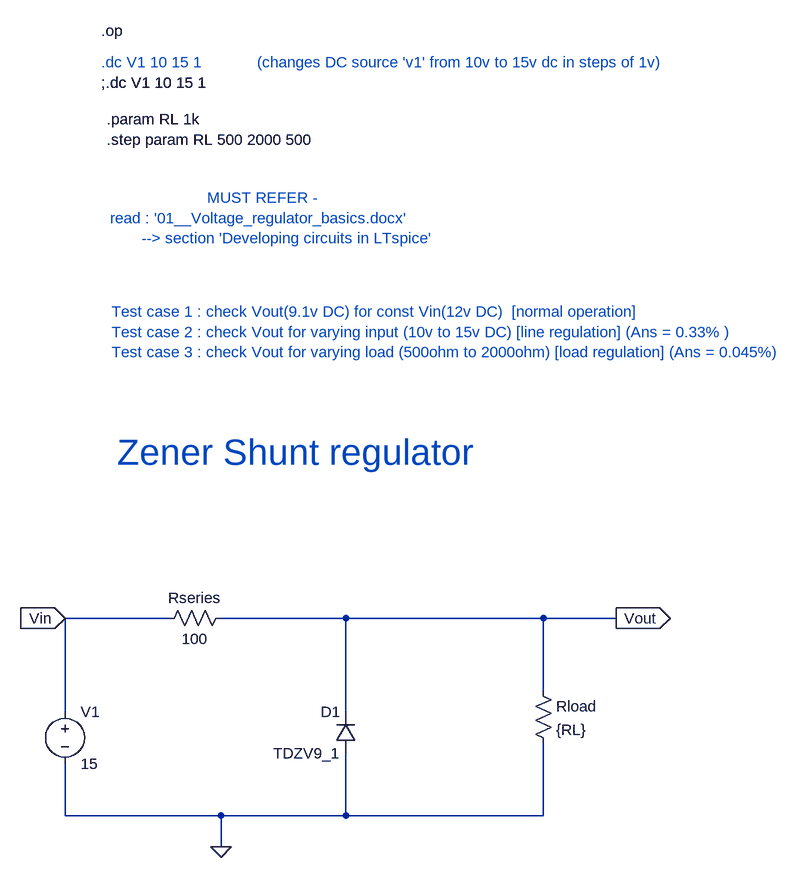
[diagram p0: schematic Zener_shunt_regulator.asc]
Zener_shunt_regulator.asc, the LTspice schematic file:
Version 4.1
SHEET 1 1056 1012
WIRE -1472 640 -1632 640
WIRE -1200 640 -1392 640
WIRE -896 640 -1200 640
WIRE -784 640 -896 640
WIRE -896 752 -896 640
WIRE -1632 784 -1632 640
WIRE -1200 784 -1200 640
WIRE -1632 944 -1632 864
WIRE -1392 944 -1632 944
WIRE -1200 944 -1200 848
WIRE -1200 944 -1392 944
WIRE -896 944 -896 832
WIRE -896 944 -1200 944
WIRE -1392 992 -1392 944
FLAG -1392 992 0
FLAG -784 640 Vout
IOPIN -784 640 Out
FLAG -1632 640 Vin
IOPIN -1632 640 In
SYMBOL voltage -1632 768 R0
WINDOW 123 0 0 Left 0
WINDOW 39 0 0 Left 0
SYMATTR InstName V1
SYMATTR Value 15
SYMBOL res -1376 624 R90
WINDOW 0 0 56 VBottom 2
WINDOW 3 32 56 VTop 2
SYMATTR InstName Rseries
SYMATTR Value 100
SYMBOL res -912 736 R0
SYMATTR InstName Rload
SYMATTR Value {RL}
SYMBOL diode -1184 848 R180
WINDOW 0 24 64 Left 2
WINDOW 3 24 0 Left 2
SYMATTR InstName D1
SYMATTR Value TDZV9_1
TEXT -1576 -264 Left 2 !.op
TEXT -1552 384 Left 5 ;Zener Shunt regulator
TEXT -1576 -216 Left 2 ;.dc V1 10 15 1
TEXT -1336 -216 Left 2 ;(changes DC source 'v1' from 10v to 15v dc in steps of 1v)
TEXT -1328 24 Center 2 ;MUST REFER -\nread : '01__Voltage_regulator_basics.docx' \n           --> section 'Developing circuits in LTspice'
TEXT -1560 168 Left 2 ;Test case 1 : check Vout(9.1v DC) for const Vin(12v DC)  [normal operation]\nTest case 2 : check Vout for varying input (10v to 15v DC) [line regulation] (Ans = 0.33% )\nTest case 3 : check Vout for varying load (500ohm to 2000ohm) [load regulation] (Ans = 0.045%)
TEXT -1568 -128 Left 2 !.param RL 1k\n.step param RL 500 2000 500
TEXT -1576 -184 Left 2 !;.dc V1 10 15 1
TEXT -1576 -184 Left 2 !;.dc V1 10 15 1

The netlist it stands for:
* Zener_shunt_regulator.asc
V1 Vin 0 15
Rseries Vout Vin 100
Rload Vout 0 {RL}
D1 0 Vout TDZV9_1
.model D D
.lib standard.dio
.op
* Zener Shunt regulator
* .dc V1 10 15 1
* (changes DC source 'v1' from 10v to 15v dc in steps of 1v)
* MUST REFER -
* read : '01__Voltage_regulator_basics.docx'
*            --> section 'Developing circuits in LTspice'
* Test case 1 : check Vout(9.1v DC) for const Vin(12v DC)  [normal operation]
* Test case 2 : check Vout for varying input (10v to 15v DC) [line regulation] (Ans = 0.33% )
* Test case 3 : check Vout for varying load (500ohm to 2000ohm) [load regulation] (Ans = 0.045%)
.param RL 1k
.step param RL 500 2000 500
;.dc V1 10 15 1
;.dc V1 10 15 1
.backanno
.end